# EasyEDA Pro project WENAD637有效值测量.epro

# Board PCB图_1
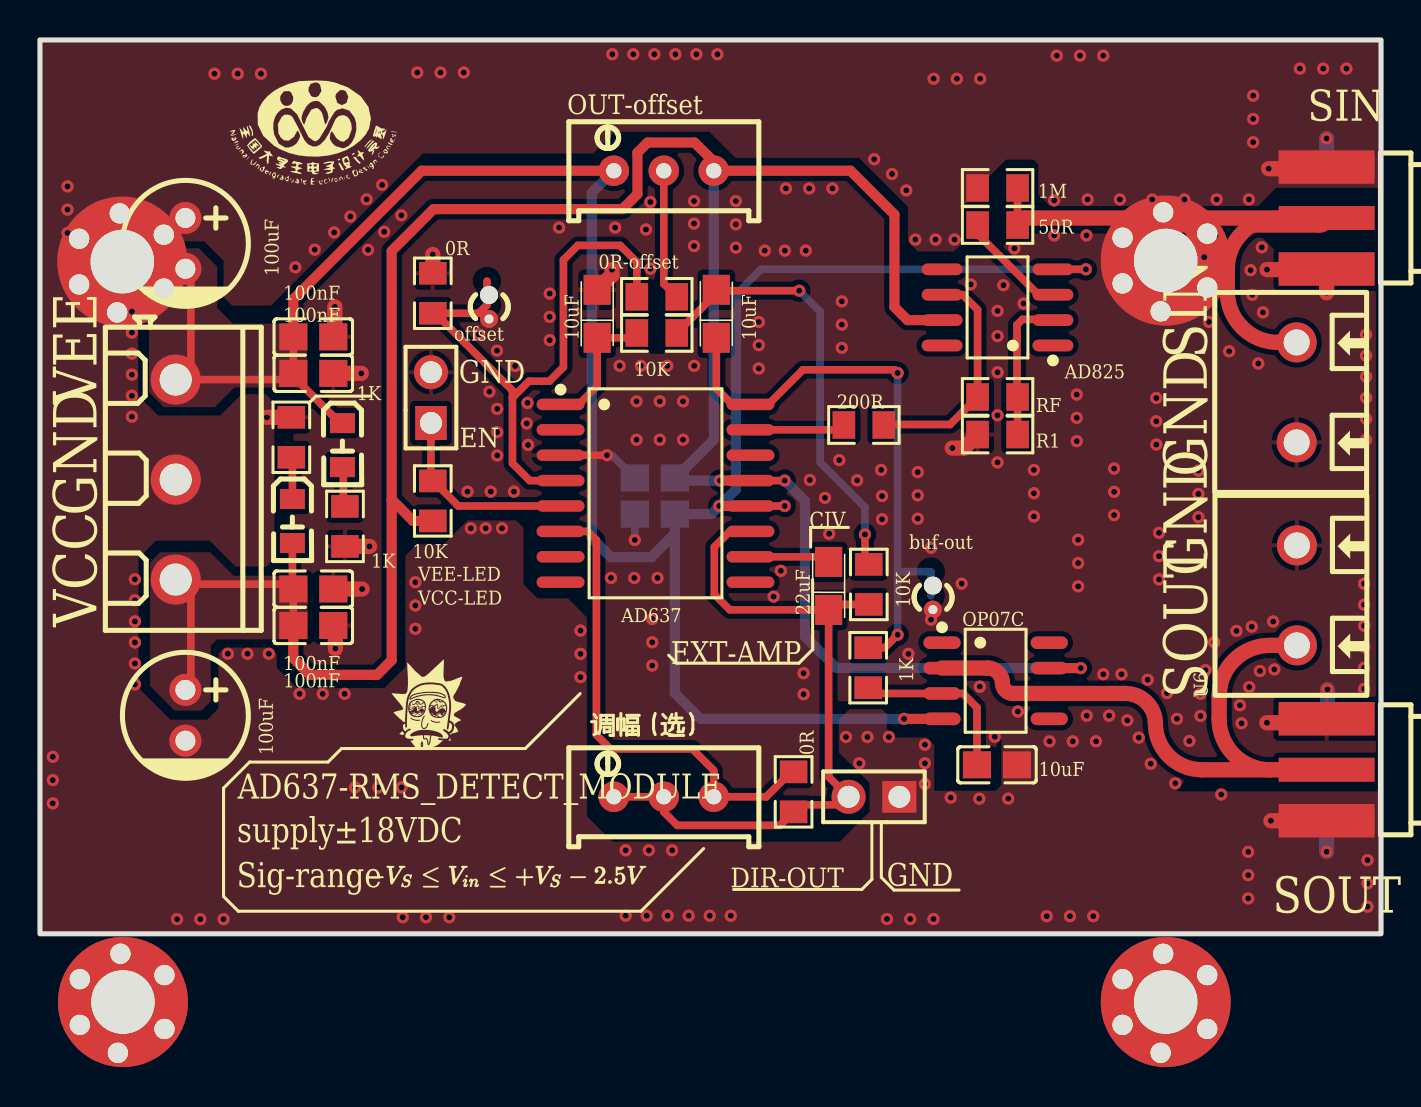
[diagram p0: board, top side]
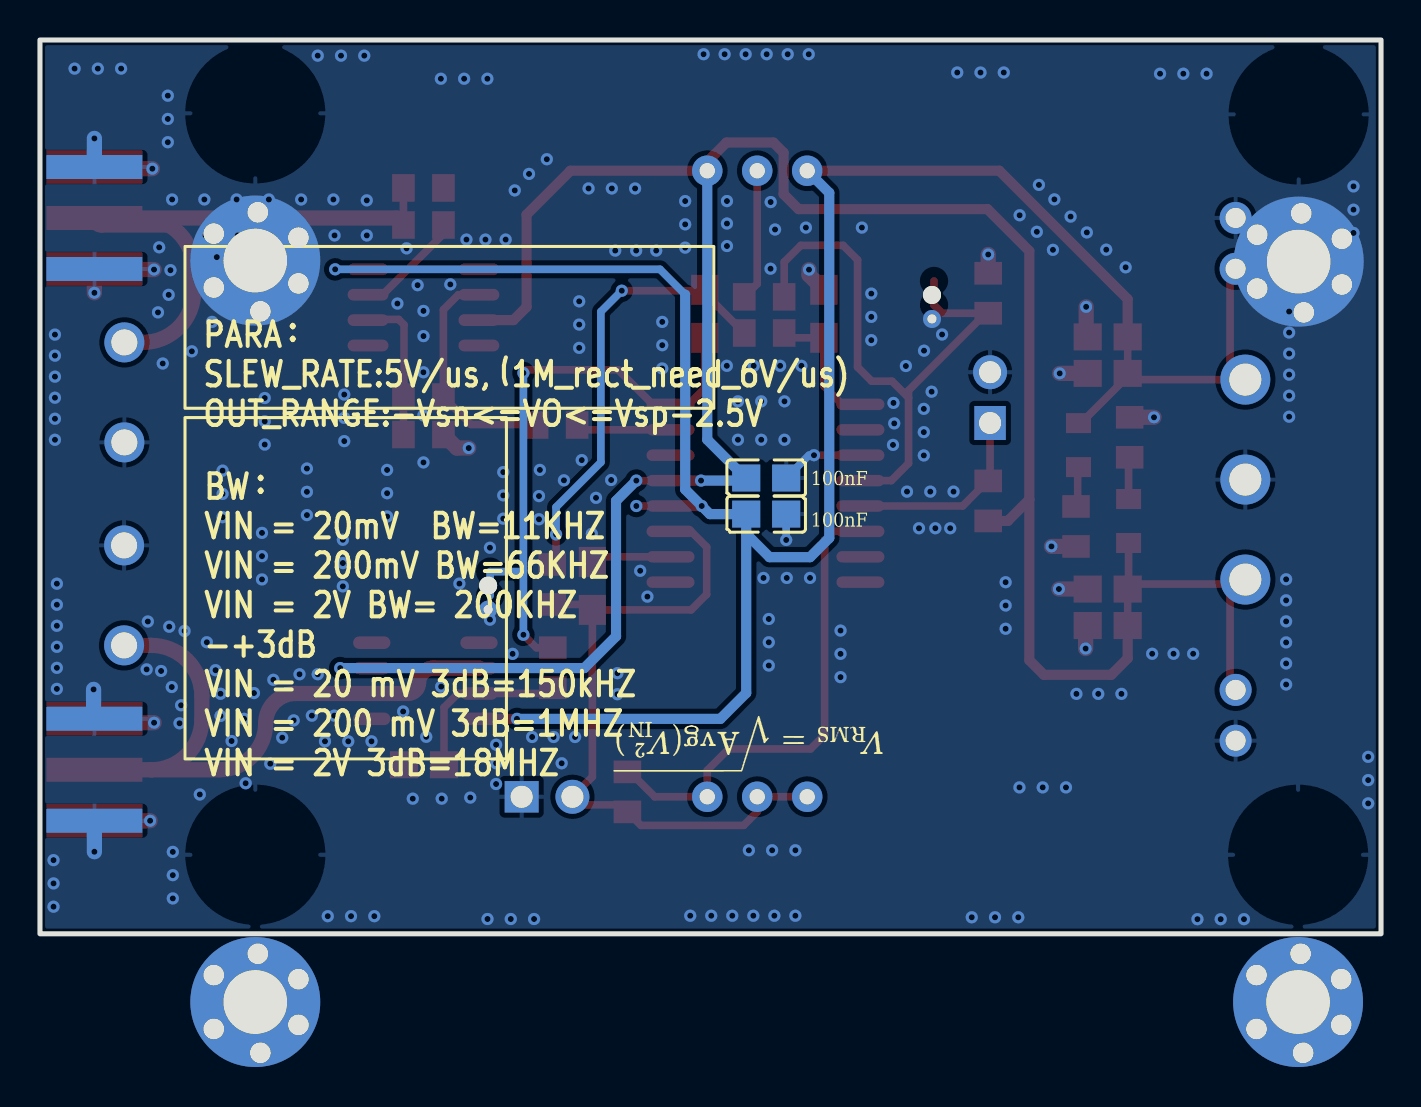
[diagram p1: board, bottom side, seen from below]

Outline 67.1 x 44.7 mm; copper layers: Top Layer, Bottom Layer. Coordinates in mm from the lower left corner of the outline.
Outline path: rectangle 0,44.7 67.1,0
Stack: Top Layer 0.035mm / Dielectric1 1.51mm FR4 er 4.5 / Bottom Layer 0.035mm

## Design rules (mm)
net VCC: PWR
net VEE: PWR
template: 自定义配置
spacing copperThickness1oz (default): track to track 0.102, other pairs 0 to 0.3
spacing copperThickness2oz: track to track 0.203, other pairs 0.152 to 0.3
track width copperThickness1oz (default): min 0.127, default 0.254, max 2.54
track width copperThickness2oz: min 0.203, default 0.254, max 2.54
track width PWR: min 0.127, default 0.508, max 2.54
differential pair differentialPair (default): width min 0.127, default 0.254, max 2.54; gap min 0.152, default 0.152
via viaSize (default): diameter min 0.5, default 0.61, max 10; hole min 0.3, default 0.305, max 6.299
net class PWR uses PWR
net VCC uses PWR
net VEE uses PWR

## Placement (name value [footprint] x y rotation side)
0R  -  [R0805]  19.65 32.03 270 top
0R#2  -  [R0805]  37.71 7.1 270 top
0R-offset  0R  [R0805]  30.86 31.85 180 top
1K  -  [R0805]  15.26 20.37 270 top
1K#2  -  [R0805]  12.58 24.83 90 top
1K#3  -  [R0805]  41.44 13.31 270 top
1M  1M  [R0805]  47.91 37.3 0 top
10K  -  [R0805]  41.47 17.47 270 top
10K#2  -  [R0805]  30.86 30.05 0 top
10K#3  -  [R0805]  19.65 21.65 90 top
10uF  -  [CASE-A_3216]  33.84 31.01 90 top
10uF#2  -  [CASE-A_3216]  27.88 31.01 90 top
10uF#3  -  [C0805]  47.88 8.45 180 top
22uF  22uF  [CASE-A_3216]  39.46 17.4 90 top
50R  50R  [R0805]  47.91 35.45 180 top
100nF  -  [C0805]  13.67 15.42 180 top
100nF#2  -  [C0805]  13.67 28.03 180 top
100nF#3  -  [C0805]  13.67 17.24 180 top
100nF#4  -  [C0805]  13.67 29.85 180 top
100nF#5  -  [C0805]  30.76 22.8 0 bottom
100nF#6  -  [C0805]  30.76 20.99 0 bottom
100uF  -  [CAP-TH_BD6.3-P2.50-D1.0-FD]  7.28 10.93 270 top
100uF#2  -  [CAP-TH_BD6.3-P2.50-D1.0-FD]  7.28 34.53 270 top
200R  200R  [R0805]  41.22 25.45 0 top
AD637  AD637JRZ  [SOIC-16_L10.3-W7.5-P1.27-LS10.3-BL]  30.8 22.03 270 top
AD825  AD825ARZ-REEL7  [SOIC-8_L4.9-W3.9-P1.27-LS6.0-BL]  47.91 31.33 90 top
buf-out  -  [测试环]  44.62 17.52 270 top
DIR-OUT  HDR-M-2.54_1x2  [HDR-M-2.54_1X2]  41.73 6.85 180 top
EN  HDR-M-2.54_1x2  [HDR-M-2.54_1X2]  19.56 26.82 90 top
H1  -  [125 X 300]  56.32 3.95 270 top
H2  -  [125 X 300]  56.32 41.03 270 top
H3  -  [125 X 300]  4.15 3.95 270 top
H4  -  [125 X 300]  4.12 40.98 270 top
offset  -  [测试环]  22.42 32.05 270 top
OP07C  OP07C/TR  [SOP-8_L4.9-W3.9-P1.27-LS6.0-BL]  47.81 12.65 270 top
OUT-offset  10kΩ  [RES-ADJ-TH_3P-L10.0-W10.0-P2.50-L]  31.21 38.16 0 top
R1  7.5K  [R0805]  47.91 24.97 0 top
RF  200R  [R0805]  47.91 26.85 180 top
SIN  BWSMA-KE-P001  [SMA-SMD_BWSMA-KE-P001]  64.38 35.8 0 top
SOUT  BWSMA-KE-P001  [SMA-SMD_BWSMA-KE-P001]  64.38 8.2 0 top
U1  DB301V-5.0-3P-BU-S  [CONN-TH_DB301V-5.0-3P]  6.79 22.72 270 top
U2  DB301V-5.0-2P-BU-S  [CONN-TH_2P-P5.00_L7.6-W10.0]  62.88 27.08 90 top
U6  DB301V-5.0-2P-BU-S  [CONN-TH_2P-P5.00_L7.6-W10.0]  62.89 16.92 90 top
VCC-LED  -  [LED_0805]  12.63 20.59 270 top
VEE-LED  -  [LED_0805]  15.13 24.39 270 top
调幅（选）  10kΩ  [RES-ADJ-TH_3P-L10.0-W10.0-P2.50-L]  31.21 6.85 0 top

## Footprints (pads in the part's own frame, mm; a bottom-side part is the same pattern mirrored in y, then rotated)
125 X 300
  round 1.016 hole 1.021x1.016: 1(4.95,-0.127) 1(6.017,2.078) 1(6.22,-2.159) 1(8.506,-2.159) 1(8.71,2.078) 1(9.903,-0.254)
  round 6.5 hole 3.18x3.175: 1(7.363,0)
C0805
  rect 1.41x1.35 smd: 1(-1,0) 2(1,0)
CAP-TH_BD6.3-P2.50-D1.0-FD
  round 1.6 hole 1: 1(-1.27,0) 2(1.27,0)
CASE-A_3216
  rect 1.5x1.359 smd: 1(-1.2,0) 2(1.2,0)
CONN-TH_2P-P5.00_L7.6-W10.0
  round 2 hole 1.3: 1(-2.5,0) 2(2.5,0)
CONN-TH_DB301V-5.0-3P
  round 2.5 hole 1.6: 1(-5,0) 2(0,0) 3(5,0)
HDR-M-2.54_1X2
  rect 1.7x1.575 hole 1.1: 1(-1.27,0)
  round 1.7 hole 1.1: 2(1.27,0)
LED_0805
  rect 1x1.25 smd: 1(-1.15,0.005) 2(1.05,0.005)
R0805
  rect 1.133x1.377 smd: 1(-1,0) 2(1,0)
RES-ADJ-TH_3P-L10.0-W10.0-P2.50-L
  round 1.524 hole 0.762: 1(-2.5,0) 2(0,0) 3(2.5,0)
SMA-SMD_BWSMA-KE-P001
  rect 4.8x1.677 smd: 1(0,-2.55) 2(0,2.55)
  rect 4.8x1.2 smd far side: 3(0,2.55) 4(0,-2.55)
  rect 4.8x1.2 smd: 5(0,0)
SOIC-8_L4.9-W3.9-P1.27-LS6.0-BL
  oval 0.588x2.045 smd: 1(-1.905,-2.772) 2(-0.635,-2.772) 3(0.635,-2.772) 4(1.905,-2.772) 5(1.905,2.772) 6(0.635,2.772) 7(-0.635,2.772) 8(-1.905,2.772)
SOIC-16_L10.3-W7.5-P1.27-LS10.3-BL
  oval 0.574x2.401 smd: 1(-4.445,-4.75) 2(-3.175,-4.75) 3(-1.905,-4.75) 4(-0.635,-4.75) 5(0.635,-4.75) 6(1.905,-4.75) 7(3.175,-4.75) 8(4.445,-4.75) 9(4.445,4.75) 10(3.175,4.75) 11(1.905,4.75) 12(0.635,4.75) 13(-0.635,4.75) 14(-1.905,4.75) 15(-3.175,4.75) 16(-4.445,4.75)
SOP-8_L4.9-W3.9-P1.27-LS6.0-BL
  oval 0.63x1.865 smd: 1(-1.905,-2.683) 2(-0.635,-2.683) 3(0.635,-2.683) 4(1.905,-2.683) 5(1.905,2.683) 6(0.635,2.683) 7(-0.635,2.683) 8(-1.905,2.683)
测试环
  round 0.9 hole 0.914x0.45: 1(0.103,0.051)
  round 0.9 hole 0.45: 1(1.304,0.051)

## Nets
GND: 0R.1 1K.2 1K#2.2 1M.1 10uF#2.2 10uF#3.1 100nF.1 100nF#2.1 100nF#3.1 100nF#4.1 100nF#5.1 100nF#6.1 100uF.2 100uF#2.1 AD637.3 DIR-OUT.1 EN.2 H1.1 H2.1 H3.1 H4.1 R1.1 SIN.1 SIN.2 SIN.3 SIN.4 SOUT.1 SOUT.2 SOUT.3 SOUT.4 U1.2 U2.1 U6.2
VCC: 10K#3.1 100nF.2 100nF#3.2 100nF#5.2 100uF.1 AD637.13 AD825.7 OP07C.7 OUT-offset.3 U1.3 VCC-LED.2
VEE: 100nF#2.2 100nF#4.2 100nF#6.2 100uF#2.2 AD637.12 AD825.4 OP07C.4 OUT-offset.1 U1.1 VEE-LED.1
CS: 10K#3.2 AD637.5 EN.1
DC_OUT: 0R#2.2 10K.2 22uF.1 AD637.11 DIR-OUT.2 调幅（选）.1 调幅（选）.2
RMS_IN: 200R.2 AD825.6 RF.2
$1N1248: 200R.1 AD637.15
$1N1258: 0R-offset.1 OUT-offset.2
$1N1261: 10K.1 10K#2.2 10uF.2
$1N1262: 10K#2.1 10uF#2.1 AD637.1
$1N1264: 1K#3.2 10uF#3.2 OP07C.3
$1N1274: OP07C.2 OP07C.6 SOUT.5 U6.1
$1N1307: 1K.1 VEE-LED.2
$1N1575: 1K#2.1 VCC-LED.1
$1N3769: 50R.2 AD825.3
$1N3776: 1M.2 50R.1 SIN.5 U2.2
$1N3919: AD825.2 R1.2 RF.1
$1N4147: 0R.2 0R-offset.2 AD637.4 offset.1
$1N4679: 0R#2.1 AD637.6 调幅（选）.3
$1N4762: 1K#3.1 10uF.1 AD637.16 buf-out.1
$1N4821: 22uF.2 AD637.10

Pads without a net: AD637 2 7 8 9 14; AD825 1 5 8; OP07C 1 5 8

## Via types
v1: diameter 0.61, hole 0.305, Top Layer to Bottom Layer, 311 vias

## Routing (per net, layer and track width the routed paths; a pad name or vN(x,y) marks a point on that pad's centre or on a via; arc(x,y) is an arc through that point)
GND: length 34.7
  Top Layer w0.381: AD637.3 v1(28.37,23.94)
  Top Layer w0.762: 100nF#4.1 14.75,29.93 v1(14.75,31.36) ; 10uF#2.2 28.62,32.95 v1(28.62,33.21) ; v1(61.48,38.26) 64.29,38.26 SIN.2 ; 100nF#3.1 v1(16.12,17.24) ; 1K.2 v1(16.49,19.37) ; v1(61.39,10.56) 64.18,10.56 SOUT.2 ; SOUT.1 v1(61.59,5.65) ; 100nF.1 14.78,15.31 v1(14.78,14.27) ; 0R.1 v1(19.65,33.97) ; 1K#2.2 v1(11.36,25.83) ; v1(45.65,24.29) 46.24,24.29 R1.1 ; 100nF#2.1 v1(16.08,28.03) ; v1(64.38,32.06) SIN.1 64.35,33.22 v1(61.39,33.22)
  Bottom Layer w0.381: 100nF#5.1 28.62,23.94 v1(28.37,23.94) ; 100nF#6.1 v1(29.76,19.7)
  Bottom Layer w0.762: SIN.2 v1(64.38,39.78) ; v1(64.42,12.22) 64.42,10.79 SOUT.2 ; 64.38,5.65 v1(64.38,4.1)
  vias: v1(0.64,8.85) v1(0.64,7.69) v1(0.64,6.52) v1(1.38,37.38) v1(1.38,36.22) v1(1.38,35.05) v1(4.6,31.12) v1(4.6,30.07) v1(4.6,29.02) v1(4.6,27.96) v1(4.6,26.91) v1(4.6,25.86) v1(4.75,17.73) v1(4.75,16.68) v1(4.75,15.62) v1(4.75,14.57) v1(4.75,13.52) v1(4.75,12.47) v1(6.86,0.73) v1(8.02,0.73) v1(8.73,43.01) v1(9.19,0.73) v1(9.4,14.01) v1(9.89,43.01) v1(10.38,14.01) v1(11.06,43.01) v1(11.45,14.01) v1(12.78,33.33) v1(12.99,12) v1(13.75,34.21) v1(14.15,12) v1(14.72,35.08) v1(15.24,12) v1(15.53,35.87) v1(15.76,7.32) v1(16.34,36.73) v1(16.41,34.21) v1(16.93,7.32) v1(17.12,37.45) v1(17.22,35.11) v1(18.08,35.93) v1(18.09,7.32) v1(18.15,0.83) v1(18.78,17.58) v1(18.78,16.42) v1(18.78,15.25) v1(18.88,43.07) v1(19.31,0.83) v1(20.04,43.07) v1(20.48,0.83) v1(21.2,43.07) v1(21.39,22.11) v1(21.56,20.28) v1(21.96,29.97) v1(22.3,20.28) v1(22.48,27.11) v1(22.55,22.11) v1(22.87,29.16) v1(22.88,26.25) v1(22.88,25.09) v1(22.88,23.92) v1(23.12,20.28) v1(23.77,28.4) v1(23.72,22.11) v1(24.36,25.53) v1(24.39,26.55) v1(24.42,24.45) v1(25.5,32.02) v1(25.5,30.85) v1(25.5,29.69) v1(25.97,35.32) v1(27.04,15.16) v1(27.04,14) v1(27.04,12.84) v1(28.57,17.8) v1(28.63,43.99) v1(28.78,35.32) v1(29,28.41) v1(29.3,4.18) v1(29.3,0.9) v1(29.69,43.99) v1(29.73,17.8) v1(29.85,26.63) v1(29.85,24.71) v1(30.07,28.41) v1(30.32,35.22) v1(30.35,0.9) v1(30.47,4.18) v1(30.54,36.6) v1(30.54,33.26) v1(30.63,15.74) v1(30.63,14.58) v1(30.63,13.42) v1(30.74,43.99) v1(30.9,17.8) v1(31.01,26.63) v1(31.01,24.71) v1(31.39,28.41) v1(31.41,0.9) v1(31.63,4.18) v1(31.79,43.99) v1(32.18,26.63) v1(32.18,24.71) v1(32.46,0.9) v1(32.73,36.64) v1(32.73,35.52) v1(32.73,34.4) v1(32.73,28.41) v1(32.84,43.99) v1(33.51,0.9) v1(33.9,43.99) v1(34.56,0.9) v1(34.82,36.64) v1(34.82,35.48) v1(34.82,34.32) v1(35.96,30.6) v1(35.96,29.44) v1(35.96,28.27) v1(36.26,34.17) v1(36.71,16.86) v1(37.07,18.15) v1(37.27,34.17) v1(37.32,37.27) v1(38.21,13.03) v1(38.21,11.98) v1(38.32,34.17) v1(38.49,37.27) v1(38.52,22.69) v1(39.28,21.8) v1(39.48,20) v1(39.65,37.27) v1(39.99,23.69) v1(40.12,31.63) v1(40.12,30.47) v1(40.12,29.3) v1(40.33,9.84) v1(40.88,22.68) v1(41,8.53) v1(41.4,9.84) v1(41.74,38.74) v1(42.09,23.2) v1(42.13,21.89) v1(42.13,20.73) v1(42.38,0.74) v1(42.47,9.84) v1(42.63,38) v1(43.34,37.18) v1(43.45,14) v1(43.54,0.74) v1(43.8,34.72) v1(43.92,23.09) v1(43.92,21.93) v1(43.92,20.76) v1(44.28,9.46) v1(44.28,8.53) v1(44.28,7.49) v1(44.58,19.31) v1(44.58,15.71) v1(44.71,42.76) v1(44.71,0.74) v1(44.81,34.72) v1(45.57,6.81) v1(45.76,34.72) v1(45.88,42.76) v1(46.11,17.51) v1(46.57,32.48) v1(47.04,42.76) v1(47.02,12.36) v1(47,6.76) v1(47.77,9.85) v1(47.91,31.15) v1(47.91,29.89) v1(47.91,28.08) v1(47.91,25.93) v1(47.91,23.57) v1(48.2,32.44) v1(48.44,6.76) v1(48.76,34.28) v1(48.93,11.12) v1(49.21,31.52) v1(49.73,23.2) v1(49.73,22.03) v1(49.73,20.87) v1(50.37,0.88) v1(50.51,9.63) v1(50.75,36.68) v1(50.75,34.93) v1(50.87,43.92) v1(51.53,0.88) v1(51.67,9.63) v1(51.87,26.97) v1(51.87,25.8) v1(51.87,24.64) v1(51.94,19.71) v1(51.94,18.54) v1(51.94,17.38) v1(52.04,43.92) v1(52.36,34.93) v1(52.37,10.91) v1(52.42,36.72) v1(52.7,0.88) v1(52.84,9.63) v1(53.2,43.92) v1(53.2,12.98) v1(53.49,10.91) v1(53.74,23.27) v1(53.74,22.1) v1(53.74,20.94) v1(53.97,34.93) v1(54.03,36.72) v1(54.11,12.98) v1(54.4,10.67) v1(54.98,9.81) v1(55.42,12.7) v1(55.58,8.51) v1(55.65,36.72) v1(55.59,34.93) v1(55.85,26.8) v1(55.85,25.63) v1(55.85,24.47) v1(55.99,20.05) v1(55.99,18.89) v1(55.99,17.72) v1(56.39,12.04) v1(56.81,7.53) v1(56.89,10.75) v1(57.26,36.72) v1(57.2,34.93) v1(57.51,9.64) v1(57.96,23.16) v1(57.96,22) v1(57.96,20.84) v1(58.06,12) v1(58.06,10.89) v1(58.25,33.84) v1(58.25,32.37) v1(58.31,13.18) v1(58.49,30.6) v1(58.75,14.58) v1(58.87,36.72) v1(58.81,34.93) v1(59.1,6.97) v1(59.5,29.13) v1(59.86,15.15) v1(60.04,11.43) v1(60.12,10.53) v1(60.45,4.1) v1(60.45,2.93) v1(60.45,1.77) v1(60.49,36.72) v1(60.57,33.19) v1(60.5,12.34) v1(60.66,31.95) v1(60.63,15.36) v1(60.7,41.92) v1(60.7,40.75) v1(60.7,39.59) v1(60.95,28.52) v1(61.04,13.14) v1(61.13,34.33) v1(61.19,31.08) v1(61.7,15.62) v1(61.76,13.22) v1(63.04,43.27) v1(64.2,43.27) v1(65.37,43.27) v1(66.25,17.51) v1(66.25,16.46) v1(66.25,15.41) v1(66.25,14.35) v1(66.25,13.3) v1(66.25,12.25) v1(66.35,29.97) v1(66.35,28.91) v1(66.35,27.86) v1(66.35,26.81) v1(66.35,25.76) v1(66.35,24.71) v1(66.42,3.68) v1(66.42,2.52) v1(66.42,1.36)
VCC: length 127.8
  Top Layer w0.381: 12.67,14.68 100nF.2 ; 100nF#3.2 12.67,15.92 ; VCC-LED.2 12.63,17.75 12.37,17.49 7.78,17.49 7.55,17.72 7.55,12.48 100uF.1 ; 35.55,22.67 v1(37.26,22.67)
  Top Layer w0.508: 17.6,21.72 18.67,20.65 10K#3.1 ; 17.6,21.72 17.6,34.15 19.69,36.24 29.14,36.24 29.89,36.99 29.89,39.06 30.4,39.57 32.75,39.57 33.71,38.61 OUT-offset.3 40.56,38.16 42.75,35.97 42.75,31.35 43.41,30.69 45.14,30.69 ; 17.6,21.72 17.6,13.68 16.87,12.95 13.5,12.95 12.67,13.78 12.67,14.68 ; OP07C.7 v1(52.08,13.29) ; 35.55,22.67 v1(34.02,22.67)
  Bottom Layer w0.508: OUT-offset.3 33.71,24.71 31.79,22.8 100nF#5.2 31.89,22.67 v1(34.02,22.67) ; v1(37.26,22.67) 38.28,21.65 38.28,14.88 39.86,13.29 v1(52.08,13.29)
VEE: length 119.5
  Top Layer w0.381: 100nF#2.2 12.67,27.88 15.01,25.54 VEE-LED.1 ; 100nF#2.2 12.36,27.72 7.55,27.72 7.55,32.98 100uF#2.2 ; 100nF#2.2 12.67,29.47 ; AD637.12 v1(37.26,21.4) ; 50.68,33.23 v1(52.33,33.23)
  Top Layer w0.508: v1(33.99,21.4) AD637.12 ; 100nF#4.2 12.67,31.74 19.1,38.16 OUT-offset.1 ; OP07C.4 v1(43.23,10.75)
  Bottom Layer w0.381: v1(52.33,33.23) 36.08,33.23 34.81,31.97
  Bottom Layer w0.508: 34.81,31.97 34.81,22.22 v1(33.99,21.4) 33.58,20.99 100nF#6.2 31.76,20 ; 31.76,20 31.76,12.04 33.05,10.75 v1(43.23,10.75) ; 31.76,20 30.59,18.84 28.57,18.84 27.61,19.8 27.61,37.06 OUT-offset.1
CS: length 9.8
  Top Layer w0.381: AD637.5 20.93,21.4 19.56,22.77 EN.1
DC_OUT: length 35.8
  Top Layer w0.381: 10K.2 39.73,16.47 22uF.1 ; 调幅（选）.1 调幅（选）.2 31.21,6.1 31.89,5.42 37.03,5.42 0R#2.2 38.06,6.45 40.05,6.45 DIR-OUT.2 39.46,7.85 22uF.1 ; 22uF.1 34.52,16.2 33.74,16.98 33.74,19.35 34.52,20.13 AD637.11
RMS_IN: length 11.7
  Top Layer w0.381: AD825.6 46.16,31.96 46.91,31.21 RF.2 45.53,25.47 42.29,25.47 42.26,25.51
$1N1248: length 4.8
  Top Layer w0.381: AD637.15 39.98,25.21 200R.1
$1N1258: length 6.6
  Top Layer w0.381: 0R-offset.1 31.21,32.5 OUT-offset.2
$1N1261: length 22.3
  Top Layer w0.381: 10K.1 41.28,18.67 v1(41.28,19.97) ; v1(37.99,32.16) 33.88,32.16 10uF.2 33.84,32.03 10K#2.2
  Bottom Layer w0.381: v1(37.99,32.16) 39.03,31.12 39.03,23.58 41.28,21.34 v1(41.28,19.97)
$1N1262: length 6.7
  Top Layer w0.381: 10K#2.1 29.62,29.81 10uF#2.1 27.88,27.39 26.96,26.48 AD637.1
$1N1264: length 8.7
  Top Layer w0.381: 1K#3.2 41.73,12.02 OP07C.3 46.18,12.02 46.88,11.32 10uF#3.2
$1N1274: length 32.6
  Top Layer w0.762: OP07C.2 47.41,13.29 arc(47.94,13.07) 48.16,12.55 arc(48.31,12.17) 48.69,12.02 OP07C.6 54.31,12.02 arc(55.37,11.58) 55.81,10.52 arc(56.49,8.88) 58.13,8.2 61.54,8.2 ; 61.54,8.2 SOUT.5 ; 61.54,8.2 arc(59.74,8.95) 59,10.74 59,11.89 arc(59,12.09) 59.03,12.3 arc(59.89,13.82) 61.54,14.42 U6.1
$1N1307: length 1.5
  Top Layer w0.381: 15.18,21.86 15.18,23.3 VEE-LED.2
$1N1575: length 2.1
  Top Layer w0.381: 1K#2.1 12.63,23.78 VCC-LED.1
$1N3769: length 5.5
  Top Layer w0.381: 50R.2 46.91,35 49.95,31.96 50.68,31.96
$1N3776: length 29.8
  Top Layer w0.381: 1M.2 48.91,35.79
  Top Layer w0.762: U2.2 61.95,29.58 arc(60.15,30.32) 59.41,32.12 59.41,33.26 arc(59.74,34.52) 60.66,35.45 64.02,35.45 arc(64.27,35.55) SIN.5 49.26,35.8 arc(49.02,35.7) 50R.1
$1N3919: length 7.3
  Top Layer w0.381: 48.91,25.09 48.91,27.04 48.88,27.07 48.88,30.46 49.15,30.73 50.65,30.73 50.68,30.69
$1N4147: length 30.6
  Top Layer w0.381: 23.64,26.81 23.64,23.53 24.5,22.67 26.05,22.67 ; 23.64,26.81 23.64,27.17 19.78,31.03 ; 23.64,26.81 24.46,27.64 25.48,27.64 26.19,28.34 26.19,33.71 26.91,34.43 29.03,34.43 29.86,33.6 0R-offset.2 ; 0R.2 19.78,31.03 ; 19.78,31.03 21.95,31.03 22.37,31.45 22.37,32.65
$1N4679: length 24.2
  Top Layer w0.381: 0R#2.1 37.58,8.1 36.34,6.85 调幅（选）.3 33.71,8.17 32.64,9.25 28.54,9.25 27.84,9.95 27.84,19.69 27.4,20.13 AD637.6
$1N4762: length 30.4
  Top Layer w0.381: v1(42.91,14.95) 42.26,14.31 1K#3.1 ; v1(42.91,28.05) 42.75,28.21 38.17,28.21 36.44,26.48 AD637.16 34.64,26.48 33.84,27.27 10uF.1
  Bottom Layer w0.381: 42.91,18.18 v1(42.91,28.05) ; 42.91,18.18 42.97,18.11 44.57,18.11 44.57,16.91 ; 42.91,18.18 v1(42.91,14.95)
$1N4821: length 4
  Top Layer w0.381: AD637.10 39.2,18.86 22uF.2

## Copper pours and planes (outline as drawn; the poured copper is in the pictures)
GND on Top Layer: 49.95,38.5 62.57,38.5 62.57,36.39 49.95,36.39
GND on Top Layer: 66.92,34.08 61.9,34.08 60.96,35.02 48.81,35.02 47.57,33.78 43.25,33.78 42.69,34.34 42.75,34.34 42.75,35.97 40.56,38.16 34.16,38.16 32.75,39.57 30.4,39.57 28.99,38.16 19.62,38.16 12.67,31.22 12.67,13.78 13.5,12.95 16.87,12.95 17.6,13.68 17.6,19.35 19.21,20.96 24.05,20.96 24.31,20.7 24.31,17.58 25.05,16.84 26.71,16.84 27.49,16.06 27.49,6.05 28.59,4.95 39.77,4.95 40.35,5.53 40.35,7.98 39.46,8.87 39.46,11.59 39.51,11.64 42.75,11.64 42.97,11.42 42.97,10.38 43.27,10.07 44.72,10.07 45.15,9.64 45.15,7.35 47.88,7.35 47.88,9.74 54.23,9.74 56.43,7.53 66.55,7.53 67.08,8.07 67.08,33.92
GND on Top Layer: -0.01,44.75 67.04,44.75 67.04,0.02 -0.01,0.02
GND on Bottom Layer: -0.23,44.83 67.33,44.83 67.33,-0.23 -0.23,-0.23
VCC on Top Layer: 5.51,19.08 13.4,19.08 13.4,11.16 5.51,11.16
VEE on Top Layer: 5.46,34.28 13.37,34.28 13.37,26.34 5.46,26.34

## Text on the board
Bottom Silkscreen Layer: BW： / VIN = 20mV  BW=11KHZ / VIN = 200mV BW=66KHZ / VIN = 2V BW= 200KHZ / -+3dB / VIN = 20 mV 3dB=150kHZ / VIN = 200 mV 3dB=1MHZ / VIN = 2V 3dB=18MHZ | PARA： / SLEW_RATE:5V/us,（1M_rect_need_6V/us) / OUT_RANGE:-Vsn<=VO<=Vsp-2.5V
Top Silkscreen Layer: Sig-range | supply±18VDC | AD637-RMS_DETECT_MODULE | VEE | GND | VCC | SIN | SOUT | CIV | EXT-AMP
